# Altium project Relays.PrjPcb
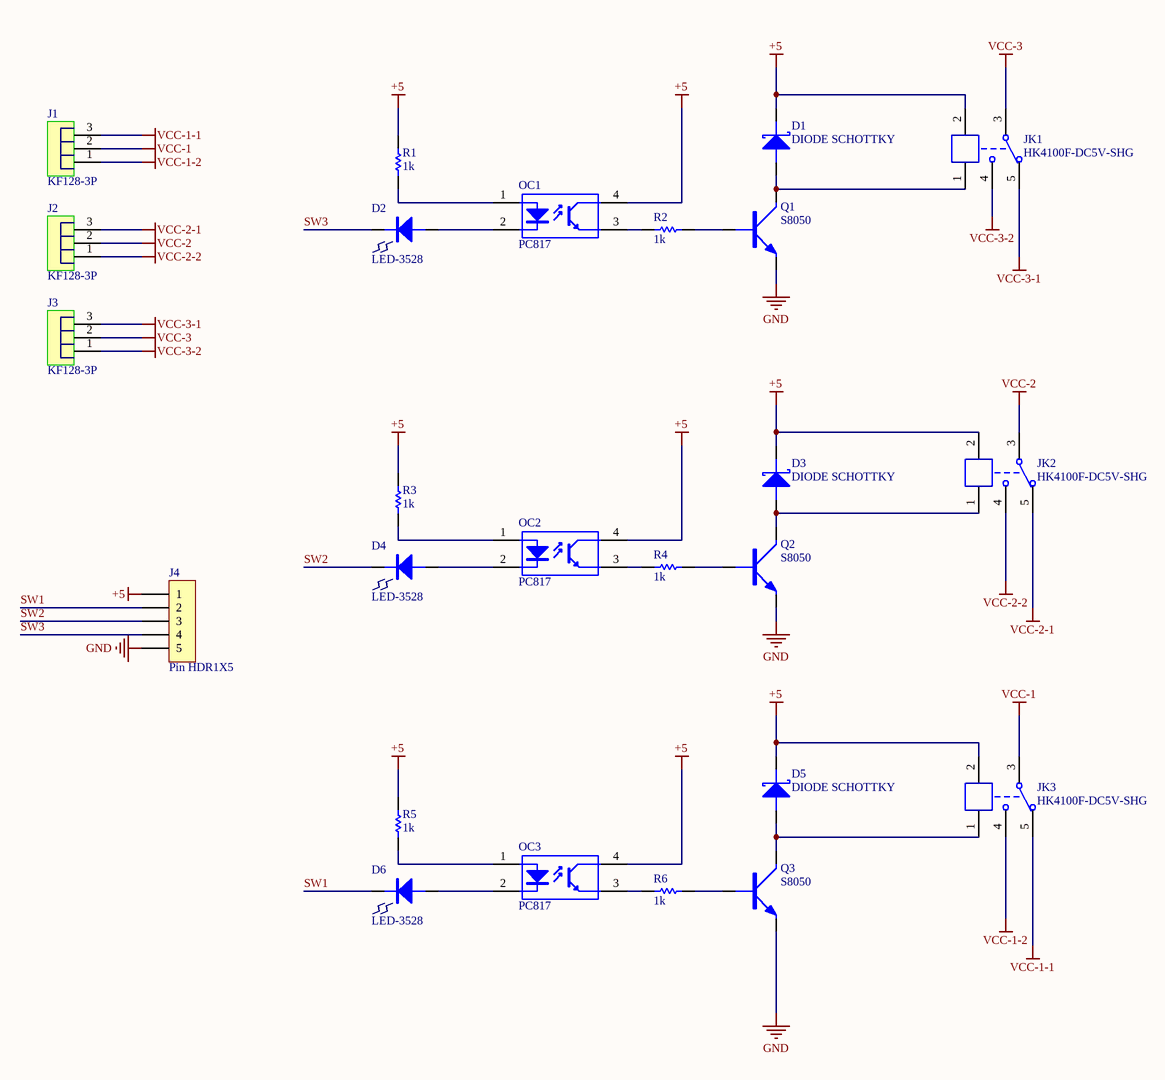
[diagram p0: Sheet1.SchDoc]
1 sheet, 25 parts. Net scope: global (net labels, ports and power ports of the same name join across sheets).
Board file: PCB1.PcbDoc

## Sheet Sheet1.SchDoc
size A2; SheetNumber: 1; SheetTotal: 1

### Parts
D1  DIODE SCHOTTKY  [SMA/DO-214AC]
D2  LED-3528  [LED-3528R]
D3  DIODE SCHOTTKY  [SMA/DO-214AC]
D4  LED-3528  [LED-3528R]
D5  DIODE SCHOTTKY  [SMA/DO-214AC]
D6  LED-3528  [LED-3528R]
J1  KF128-3P  [KF128-3.81-3P]
J2  KF128-3P  [KF128-3.81-3P]
J3  KF128-3P  [KF128-3.81-3P]
J4  Pin HDR1X5  [Pin HDR1X5/2.54mm-S]
JK1  HK4100F-DC5V-SHG  [HK4100F]
JK2  HK4100F-DC5V-SHG  [HK4100F]
JK3  HK4100F-DC5V-SHG  [HK4100F]
OC1  PC817  [SMD_PC817]
OC2  PC817  [SMD_PC817]
OC3  PC817  [SMD_PC817]
Q1  S8050  [SOT-23]
Q2  S8050  [SOT-23]
Q3  S8050  [SOT-23]
R1  1k  [0805R]
R2  1k  [0805R]
R3  1k  [0805R]
R4  1k  [0805R]
R5  1k  [0805R]
R6  1k  [0805R]

### Nets
+5: D1.K D3.K D5.K J4.1 JK1.2 JK2.2 JK3.2 OC1.4(C) OC2.4(C) OC3.4(C) R1.1 R3.1 R5.1
GND: J4.5 Q1.E Q2.E Q3.E
VCC-1: J1.2 JK3.3
VCC-1-1: J1.3 JK3.5
VCC-1-2: J1.1 JK3.4
VCC-2: J2.2 JK2.3
VCC-2-1: J2.3 JK2.5
VCC-2-2: J2.1 JK2.4
VCC-3: J3.2 JK1.3
VCC-3-1: J3.3 JK1.5
VCC-3-2: J3.1 JK1.4
SW1: D6.K J4.2
SW2: D4.K J4.3
SW3: D2.K J4.4
NetD1_A: D1.A JK1.1 Q1.C
NetD2_A: D2.A OC1.2(K)
NetD3_A: D3.A JK2.1 Q2.C
NetD4_A: D4.A OC2.2(K)
NetD5_A: D5.A JK3.1 Q3.C
NetD6_A: D6.A OC3.2(K)
NetOC1_1: OC1.1(A) R1.2
NetOC1_3: OC1.3(E) R2.2
NetOC2_1: OC2.1(A) R3.2
NetOC2_3: OC2.3(E) R4.2
NetOC3_1: OC3.1(A) R5.2
NetOC3_3: OC3.3(E) R6.2
NetQ1_B: Q1.B R2.1
NetQ2_B: Q2.B R4.1
NetQ3_B: Q3.B R6.1

### Library data of the parts
D1 D3 D5 = DIODE SCHOTTKY: 肖特基二极管
JK1-JK3 = HK4100F: 一组转换
OC1-OC3 = PC817: 线性光耦
Q1-Q3 = NPN: NPN三极管
R1-R6 = RES